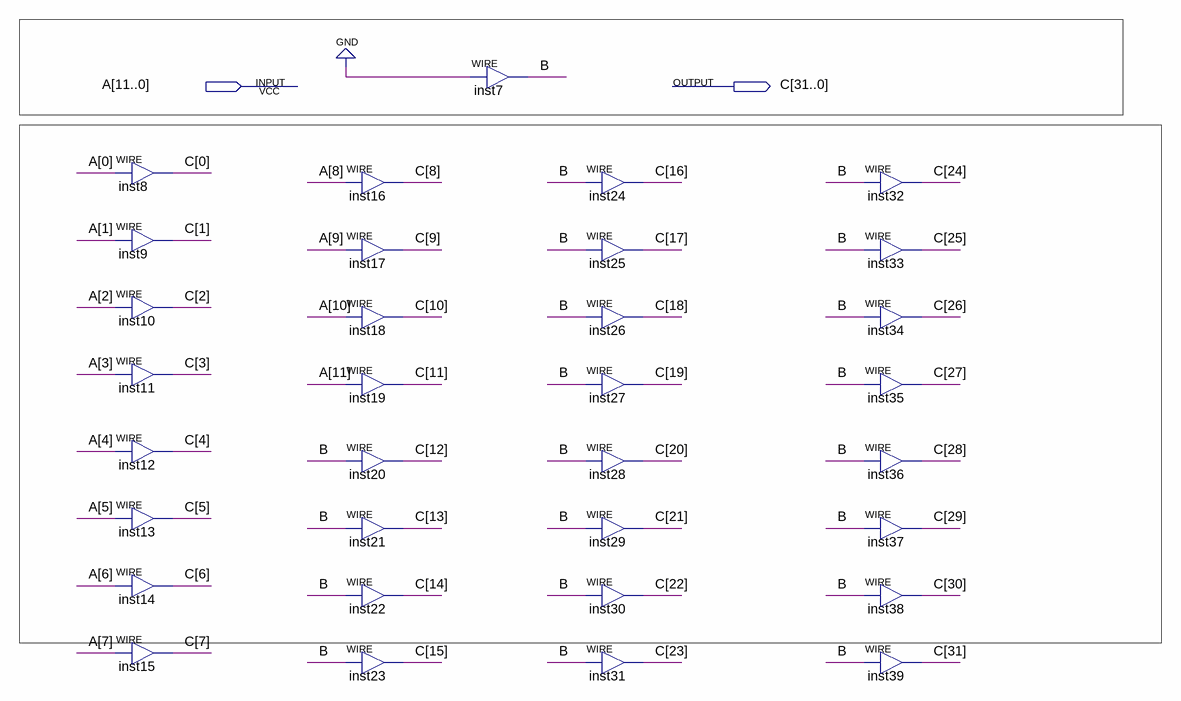
[diagram p0: schematic sheet]
// Quartus schematic ExtU_group.bdf as structural Verilog: 33 symbols, 2 pins
module ExtU_group (
  input  [11:0] A,
  output [31:0] C
);

  wire B;

  assign C[0] = A[0];  // WIRE inst8
  assign C[1] = A[1];  // WIRE inst9
  assign C[2] = A[2];  // WIRE inst10
  assign C[3] = A[3];  // WIRE inst11
  assign C[4] = A[4];  // WIRE inst12
  assign C[5] = A[5];  // WIRE inst13
  assign C[6] = A[6];  // WIRE inst14
  assign C[7] = A[7];  // WIRE inst15
  assign C[8] = A[8];  // WIRE inst16
  assign C[9] = A[9];  // WIRE inst17
  assign C[10] = A[10];  // WIRE inst18
  assign C[11] = A[11];  // WIRE inst19
  assign C[12] = B;  // WIRE inst20
  assign C[13] = B;  // WIRE inst21
  assign C[14] = B;  // WIRE inst22
  assign C[15] = B;  // WIRE inst23
  assign B = 1'b0;  // WIRE inst7
  assign C[16] = B;  // WIRE inst24
  assign C[17] = B;  // WIRE inst25
  assign C[18] = B;  // WIRE inst26
  assign C[19] = B;  // WIRE inst27
  assign C[20] = B;  // WIRE inst28
  assign C[21] = B;  // WIRE inst29
  assign C[22] = B;  // WIRE inst30
  assign C[23] = B;  // WIRE inst31
  assign C[24] = B;  // WIRE inst32
  assign C[25] = B;  // WIRE inst33
  assign C[26] = B;  // WIRE inst34
  assign C[27] = B;  // WIRE inst35
  assign C[28] = B;  // WIRE inst36
  assign C[29] = B;  // WIRE inst37
  assign C[30] = B;  // WIRE inst38
  assign C[31] = B;  // WIRE inst39
endmodule
